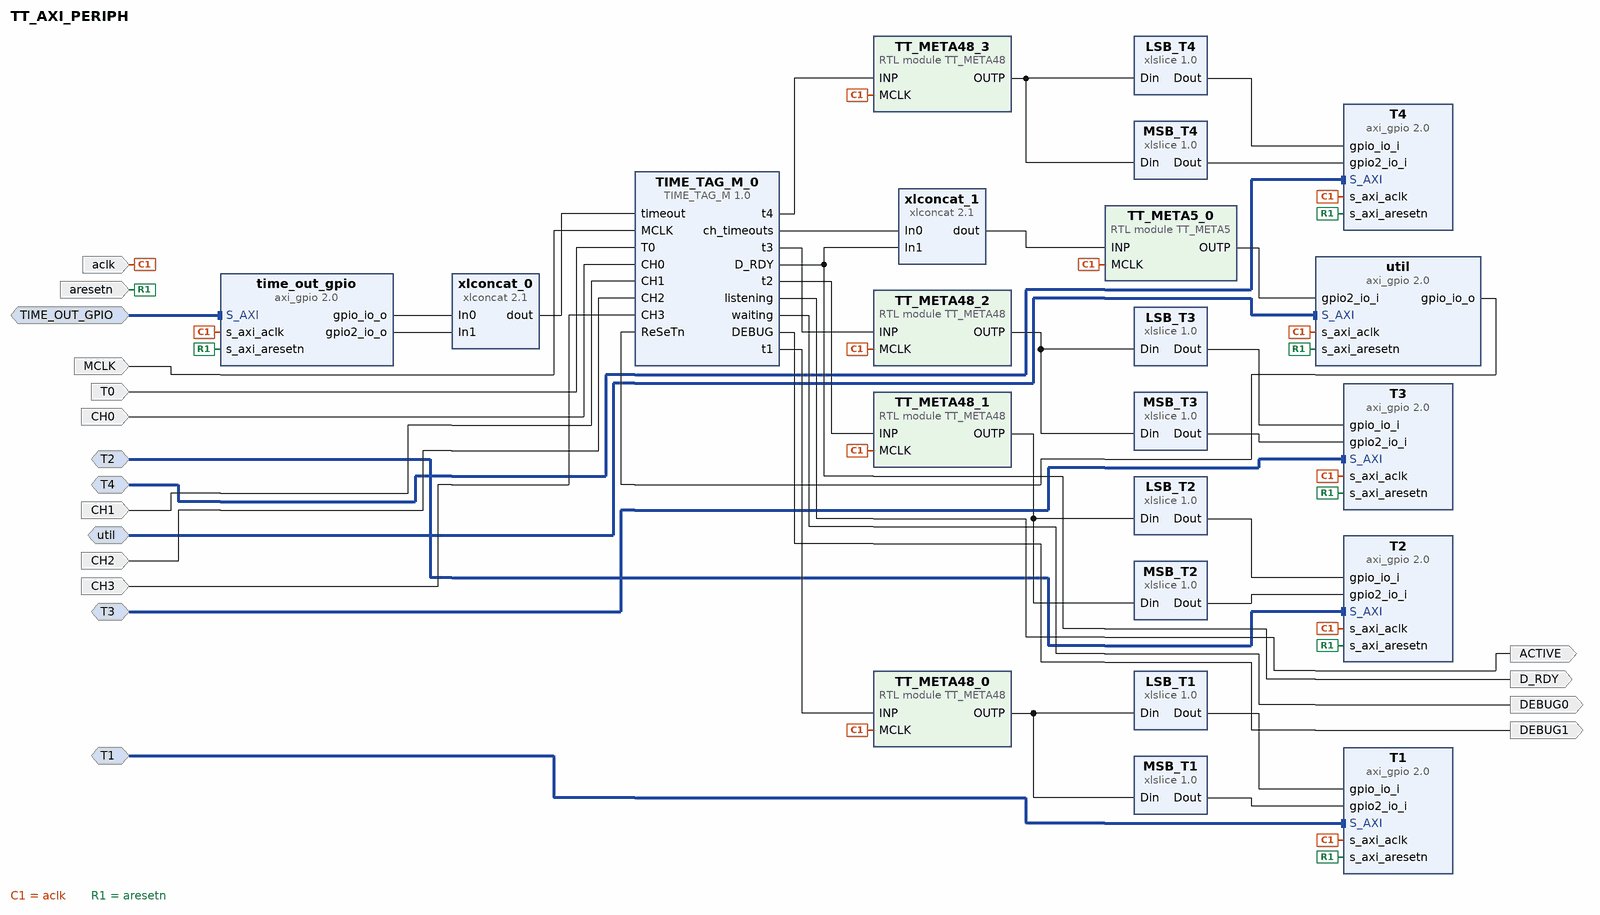
[diagram p0: block diagram of the top level]
# Vivado block design TT_AXI_PERIPH, xc7z020clg400-1, Vivado 2019.1
create_bd_design TT_AXI_PERIPH

create_bd_intf_port -mode Slave -vlnv xilinx.com:interface:aximm_tlm:1.0 util
create_bd_intf_port -mode Slave -vlnv xilinx.com:interface:aximm_tlm:1.0 TIME_OUT_GPIO
create_bd_intf_port -mode Slave -vlnv xilinx.com:interface:aximm_tlm:1.0 T1
create_bd_intf_port -mode Slave -vlnv xilinx.com:interface:aximm_tlm:1.0 T2
create_bd_intf_port -mode Slave -vlnv xilinx.com:interface:aximm_tlm:1.0 T3
create_bd_intf_port -mode Slave -vlnv xilinx.com:interface:aximm_tlm:1.0 T4
create_bd_port -dir I CH0
create_bd_port -dir I CH1
create_bd_port -dir I CH2
create_bd_port -dir I CH3
create_bd_port -dir I MCLK
create_bd_port -dir I T0
create_bd_port -dir I aclk
create_bd_port -dir I aresetn
create_bd_port -dir O D_RDY
create_bd_port -dir O DEBUG0
create_bd_port -dir O ACTIVE
create_bd_port -dir O DEBUG1

create_bd_cell -type ip -vlnv xilinx.com:ip:axi_gpio:2.0 time_out_gpio
set_property -dict [list \
  CONFIG.C_ALL_OUTPUTS 1 \
  CONFIG.C_ALL_OUTPUTS_2 1 \
  CONFIG.C_DOUT_DEFAULT 0xFFFFFFFF \
  CONFIG.C_DOUT_DEFAULT_2 0x0000FFFF \
  CONFIG.C_GPIO2_WIDTH 16 \
  CONFIG.C_IS_DUAL 1 \
] [get_bd_cells time_out_gpio]
create_bd_cell -type ip -vlnv xilinx.com:ip:xlconcat:2.1 xlconcat_0
set_property -dict {CONFIG.IN0_WIDTH 32 CONFIG.IN1_WIDTH 16} [get_bd_cells xlconcat_0]
create_bd_cell -type ip -vlnv xilinx.com:ip:axi_gpio:2.0 util
set_property -dict [list \
  CONFIG.C_ALL_INPUTS_2 1 \
  CONFIG.C_ALL_OUTPUTS 1 \
  CONFIG.C_GPIO2_WIDTH 5 \
  CONFIG.C_GPIO_WIDTH 1 \
  CONFIG.C_IS_DUAL 1 \
] [get_bd_cells util]
create_bd_cell -type ip -vlnv xilinx.com:ip:xlconcat:2.1 xlconcat_1
set_property -dict {CONFIG.IN0_WIDTH 4 CONFIG.IN1_WIDTH 1} [get_bd_cells xlconcat_1]
create_bd_cell -type ip -vlnv xilinx.com:ip:axi_gpio:2.0 T1
set_property -dict {CONFIG.C_ALL_INPUTS 1 CONFIG.C_ALL_INPUTS_2 1 CONFIG.C_GPIO2_WIDTH 16 CONFIG.C_IS_DUAL 1} [get_bd_cells T1]
create_bd_cell -type ip -vlnv xilinx.com:ip:xlslice:1.0 LSB_T1
set_property -dict {CONFIG.DIN_FROM 31 CONFIG.DIN_TO 0 CONFIG.DIN_WIDTH 48 CONFIG.DOUT_WIDTH 32} [get_bd_cells LSB_T1]
create_bd_cell -type ip -vlnv xilinx.com:ip:xlslice:1.0 MSB_T1
set_property -dict {CONFIG.DIN_FROM 47 CONFIG.DIN_TO 32 CONFIG.DIN_WIDTH 48 CONFIG.DOUT_WIDTH 16} [get_bd_cells MSB_T1]
create_bd_cell -type ip -vlnv xilinx.com:ip:xlslice:1.0 LSB_T2
set_property -dict {CONFIG.DIN_FROM 31 CONFIG.DIN_TO 0 CONFIG.DIN_WIDTH 48 CONFIG.DOUT_WIDTH 32} [get_bd_cells LSB_T2]
create_bd_cell -type ip -vlnv xilinx.com:ip:xlslice:1.0 MSB_T2
set_property -dict {CONFIG.DIN_FROM 47 CONFIG.DIN_TO 32 CONFIG.DIN_WIDTH 48 CONFIG.DOUT_WIDTH 1} [get_bd_cells MSB_T2]
create_bd_cell -type ip -vlnv xilinx.com:ip:axi_gpio:2.0 T2
set_property -dict {CONFIG.C_ALL_INPUTS 1 CONFIG.C_ALL_INPUTS_2 1 CONFIG.C_GPIO2_WIDTH 16 CONFIG.C_IS_DUAL 1} [get_bd_cells T2]
create_bd_cell -type ip -vlnv xilinx.com:ip:xlslice:1.0 LSB_T3
set_property -dict {CONFIG.DIN_FROM 31 CONFIG.DIN_TO 0 CONFIG.DIN_WIDTH 48 CONFIG.DOUT_WIDTH 32} [get_bd_cells LSB_T3]
create_bd_cell -type ip -vlnv xilinx.com:ip:xlslice:1.0 MSB_T3
set_property -dict {CONFIG.DIN_FROM 47 CONFIG.DIN_TO 32 CONFIG.DIN_WIDTH 48 CONFIG.DOUT_WIDTH 1} [get_bd_cells MSB_T3]
create_bd_cell -type ip -vlnv xilinx.com:ip:axi_gpio:2.0 T3
set_property -dict {CONFIG.C_ALL_INPUTS 1 CONFIG.C_ALL_INPUTS_2 1 CONFIG.C_GPIO2_WIDTH 16 CONFIG.C_IS_DUAL 1} [get_bd_cells T3]
create_bd_cell -type ip -vlnv xilinx.com:ip:xlslice:1.0 LSB_T4
set_property -dict {CONFIG.DIN_FROM 31 CONFIG.DIN_TO 0 CONFIG.DIN_WIDTH 48 CONFIG.DOUT_WIDTH 32} [get_bd_cells LSB_T4]
create_bd_cell -type ip -vlnv xilinx.com:ip:xlslice:1.0 MSB_T4
set_property -dict {CONFIG.DIN_FROM 47 CONFIG.DIN_TO 32 CONFIG.DIN_WIDTH 48 CONFIG.DOUT_WIDTH 1} [get_bd_cells MSB_T4]
create_bd_cell -type ip -vlnv xilinx.com:ip:axi_gpio:2.0 T4
set_property -dict {CONFIG.C_ALL_INPUTS 1 CONFIG.C_ALL_INPUTS_2 1 CONFIG.C_GPIO2_WIDTH 16 CONFIG.C_IS_DUAL 1} [get_bd_cells T4]
create_bd_cell -type module -reference TT_META5 TT_META5_0
create_bd_cell -type module -reference TT_META48 TT_META48_0
create_bd_cell -type module -reference TT_META48 TT_META48_1
create_bd_cell -type module -reference TT_META48 TT_META48_2
create_bd_cell -type module -reference TT_META48 TT_META48_3
create_bd_cell -type ip -vlnv cri.nz:user:TIME_TAG_M:1.0 TIME_TAG_M_0

# ---- connections ----

connect_bd_intf_net [get_bd_intf_ports TIME_OUT_GPIO] [get_bd_intf_pins time_out_gpio/S_AXI]
connect_bd_intf_net -intf_net T2_1 [get_bd_intf_ports T2] [get_bd_intf_pins T2/S_AXI]
connect_bd_intf_net -intf_net T1_1 [get_bd_intf_ports T1] [get_bd_intf_pins T1/S_AXI]
connect_bd_intf_net -intf_net T4_1 [get_bd_intf_ports T4] [get_bd_intf_pins T4/S_AXI]
connect_bd_intf_net [get_bd_intf_ports util] [get_bd_intf_pins util/S_AXI]
connect_bd_intf_net -intf_net T3_1 [get_bd_intf_ports T3] [get_bd_intf_pins T3/S_AXI]
connect_bd_net [get_bd_pins time_out_gpio/gpio_io_o] [get_bd_pins xlconcat_0/In0]
connect_bd_net [get_bd_pins time_out_gpio/gpio2_io_o] [get_bd_pins xlconcat_0/In1]
connect_bd_net -net TIME_TAG_wrapper_0_DATA_RDY [get_bd_pins TIME_TAG_M_0/D_RDY] [get_bd_pins xlconcat_1/In1] [get_bd_ports D_RDY]
connect_bd_net -net xlslice_2_Dout [get_bd_pins LSB_T1/Dout] [get_bd_pins T1/gpio_io_i]
connect_bd_net -net xlslice_3_Dout [get_bd_pins MSB_T1/Dout] [get_bd_pins T1/gpio2_io_i]
connect_bd_net -net xlslice_2_Dout1 [get_bd_pins LSB_T2/Dout] [get_bd_pins T2/gpio_io_i]
connect_bd_net -net xlslice_3_Dout1 [get_bd_pins MSB_T2/Dout] [get_bd_pins T2/gpio2_io_i]
connect_bd_net -net xlslice_2_Dout2 [get_bd_pins LSB_T3/Dout] [get_bd_pins T3/gpio_io_i]
connect_bd_net -net xlslice_3_Dout2 [get_bd_pins MSB_T3/Dout] [get_bd_pins T3/gpio2_io_i]
connect_bd_net -net xlslice_2_Dout3 [get_bd_pins LSB_T4/Dout] [get_bd_pins T4/gpio_io_i]
connect_bd_net -net xlslice_3_Dout3 [get_bd_pins MSB_T4/Dout] [get_bd_pins T4/gpio2_io_i]
connect_bd_net -net TIME_TAG_wrapper_0_T1 [get_bd_pins TT_META48_0/OUTP] [get_bd_pins LSB_T1/Din] [get_bd_pins MSB_T1/Din]
connect_bd_net -net TIME_TAG_wrapper_0_T2 [get_bd_pins TT_META48_1/OUTP] [get_bd_pins LSB_T2/Din] [get_bd_pins MSB_T2/Din]
connect_bd_net -net TIME_TAG_wrapper_0_T3 [get_bd_pins TT_META48_2/OUTP] [get_bd_pins LSB_T3/Din] [get_bd_pins MSB_T3/Din]
connect_bd_net -net TIME_TAG_wrapper_0_T4 [get_bd_pins TT_META48_3/OUTP] [get_bd_pins LSB_T4/Din] [get_bd_pins MSB_T4/Din]
connect_bd_net [get_bd_ports aclk] \
  [get_bd_pins time_out_gpio/s_axi_aclk] [get_bd_pins T1/s_axi_aclk] [get_bd_pins util/s_axi_aclk] \
  [get_bd_pins T4/s_axi_aclk] [get_bd_pins T3/s_axi_aclk] [get_bd_pins T2/s_axi_aclk] [get_bd_pins TT_META5_0/MCLK] \
  [get_bd_pins TT_META48_0/MCLK] [get_bd_pins TT_META48_1/MCLK] [get_bd_pins TT_META48_2/MCLK] [get_bd_pins TT_META48_3/MCLK]
connect_bd_net [get_bd_ports aresetn] \
  [get_bd_pins util/s_axi_aresetn] [get_bd_pins time_out_gpio/s_axi_aresetn] [get_bd_pins T1/s_axi_aresetn] \
  [get_bd_pins T4/s_axi_aresetn] [get_bd_pins T3/s_axi_aresetn] [get_bd_pins T2/s_axi_aresetn]
connect_bd_net [get_bd_pins util/gpio_io_o] [get_bd_pins TIME_TAG_M_0/ReSeTn]
connect_bd_net [get_bd_ports MCLK] [get_bd_pins TIME_TAG_M_0/MCLK]
connect_bd_net -net T0_1 [get_bd_ports T0] [get_bd_pins TIME_TAG_M_0/T0]
connect_bd_net -net CH0_1 [get_bd_ports CH0] [get_bd_pins TIME_TAG_M_0/CH0]
connect_bd_net -net CH1_1 [get_bd_ports CH1] [get_bd_pins TIME_TAG_M_0/CH1]
connect_bd_net -net CH2_1 [get_bd_ports CH2] [get_bd_pins TIME_TAG_M_0/CH2]
connect_bd_net -net CH3_1 [get_bd_ports CH3] [get_bd_pins TIME_TAG_M_0/CH3]
connect_bd_net [get_bd_pins xlconcat_0/dout] [get_bd_pins TIME_TAG_M_0/timeout]
connect_bd_net [get_bd_pins TIME_TAG_M_0/listening] [get_bd_ports ACTIVE]
connect_bd_net [get_bd_pins TIME_TAG_M_0/waiting] [get_bd_ports DEBUG0]
connect_bd_net [get_bd_pins TIME_TAG_M_0/ch_timeouts] [get_bd_pins xlconcat_1/In0]
connect_bd_net [get_bd_pins TIME_TAG_M_0/DEBUG] [get_bd_ports DEBUG1]
connect_bd_net [get_bd_pins TIME_TAG_M_0/t1] [get_bd_pins TT_META48_0/INP]
connect_bd_net [get_bd_pins TIME_TAG_M_0/t2] [get_bd_pins TT_META48_1/INP]
connect_bd_net [get_bd_pins TIME_TAG_M_0/t3] [get_bd_pins TT_META48_2/INP]
connect_bd_net [get_bd_pins TIME_TAG_M_0/t4] [get_bd_pins TT_META48_3/INP]
connect_bd_net [get_bd_pins xlconcat_1/dout] [get_bd_pins TT_META5_0/INP]
connect_bd_net [get_bd_pins TT_META5_0/OUTP] [get_bd_pins util/gpio2_io_i]

validate_bd_design
save_bd_design
